# EAGLE design nRF24LU1+ (EAGLE 7.0.0)
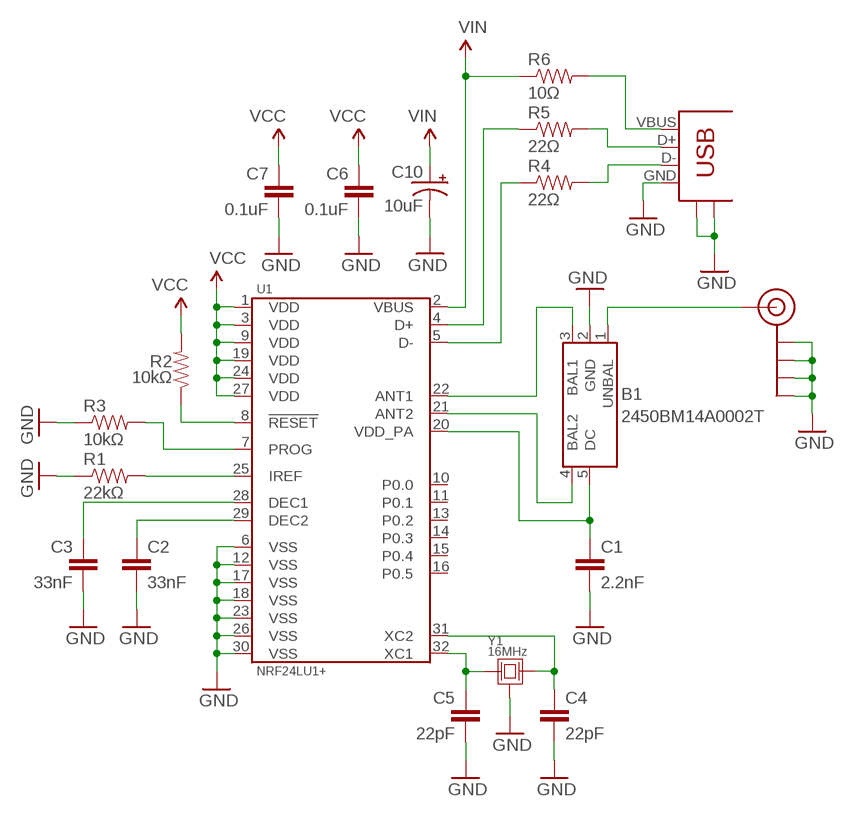
[diagram p0: schematic, sheet 1]

## Parts
B1  2450BM14A0002T  [BALUN-0603]
C1  2.2nF  CAP0402-CAP  [0402-CAP]
C2  33nF  CAP0402-CAP  [0402-CAP]
C3  33nF  CAP0402-CAP  [0402-CAP]
C4  22pF  CAP0402-CAP  [0402-CAP]
C5  22pF  CAP0402-CAP  [0402-CAP]
C6  0.1uF  CAP0402-CAP  [0402-CAP]
C7  0.1uF  CAP0402-CAP  [0402-CAP]
C10  10uF  CAP_POL0805  [0805-CAP_POL]
J1  USB+SHIELD-A-H  [USB-A-H]
J$1  SMA_EDGE  [SMA-EDGE]
R1  22kΩ  RESISTOR0402-RES  [0402-RES]
R2  10kΩ  RESISTOR0402-RES  [0402-RES]
R3  10kΩ  RESISTOR0402-RES  [0402-RES]
R4  22Ω  RESISTOR0402-RES  [0402-RES]
R5  22Ω  RESISTOR0402-RES  [0402-RES]
R6  10Ω  RESISTOR0402-RES  [0402-RES]
U1  NRF24LU1+  [QFN-32]
Y1  16MHz  CRYSTAL-3.2X2.5  [FA-238]

## Nets
GND: B1.2(GND) C1.2 C2.2 C3.2 C4.2 C5.2 C6.2 C7.2 C10.C(-) J1.GND J1.GND2(S1) J1.GND3(S2) J$1.GND@0(GND) J$1.GND@1(GND) J$1.GND@2(GND) J$1.GND@3(GND) R1.1 R3.1 U1.6(VSS) U1.12(VSS) U1.17(VSS) U1.18(VSS) U1.23(VSS) U1.26(VSS) U1.30(VSS) Y1.2(GND) Y1.4(GND)
N$1: R2.1 U1.8(!RESET)
N$2: C2.1 U1.29(DEC2)
N$3: C3.1 U1.28(DEC1)
N$4: R1.2 U1.25(IREF)
N$5: R3.2 U1.7(PROG)
N$6: C5.1 U1.32(XC1) Y1.1
N$7: C4.1 U1.31(XC2) Y1.3
N$8: B1.4(BAL2) U1.21(ANT2)
N$9: B1.3(BAL1) U1.22(ANT1)
N$10: B1.5(DC) C1.1 U1.20(VDD_PA)
N$11: B1.1(UNBAL) J$1.SIG(SIGNAL)
N$12: J1.D+ R5.2
N$13: J1.D- R4.2
N$14: J1.VBUS R6.2
N$16: R5.1 U1.4(D+)
N$17: R4.1 U1.5(D-)
VCC: C6.1 C7.1 R2.2 U1.1(VDD) U1.3(VDD) U1.9(VDD) U1.19(VDD) U1.24(VDD) U1.27(VDD)
VIN: C10.A(+) R6.1 U1.2(VBUS)
Unconnected: U1.10(P0.0) U1.11(P0.1) U1.13(P0.2) U1.14(P0.3) U1.15(P0.4) U1.16(P0.5)

## Library data of the parts
B1 = SparkFun-RF:2450BM14A0002T
C1-C7 = SparkFun-Passives:CAP: Capacitor Standard 0603 ceramic capacitor, and 0.1" leaded capacitor.
C10 = SparkFun-Passives:CAP_POL: Capacitor Polarized These are standard SMD and PTH capacitors. Normally 10uF, 47uF, and 100uF in electrolytic and tantalum varieties. Always verify the external diameter of the through hole cap, it varies with capacity, voltage, and manufacturer. The EIA devices should be standard.
J1 = SparkFun-Connectors:USB+SHIELD: USB+Shield USB connector with shield pins connectable
J$1 = SparkFun-Connectors:SMA_EDGE: SMA Antenna Connector End launch SMA connector. The paste layer has been removed so that the connector can be hand soldered onto the board after reflow.
R1-R6 = SparkFun-Passives:RESISTOR: Resistor Basic schematic elements and footprints for 0603, 1206, and PTH resistors.
U1 = Nordic:NRF24LU1+
Y1 = Passives:CRYSTAL

## Board
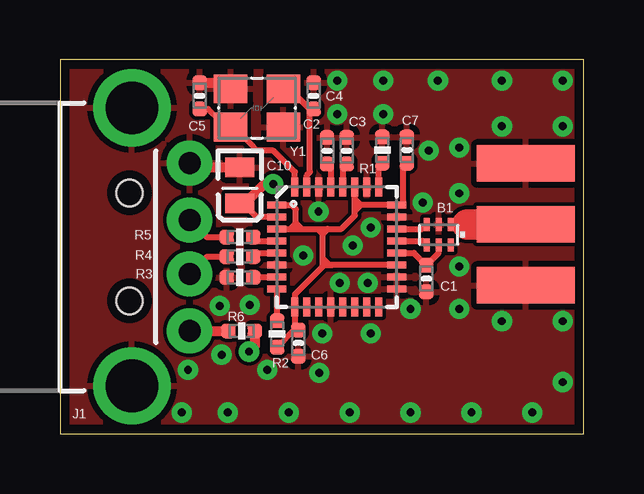
[diagram p1: board, top side]
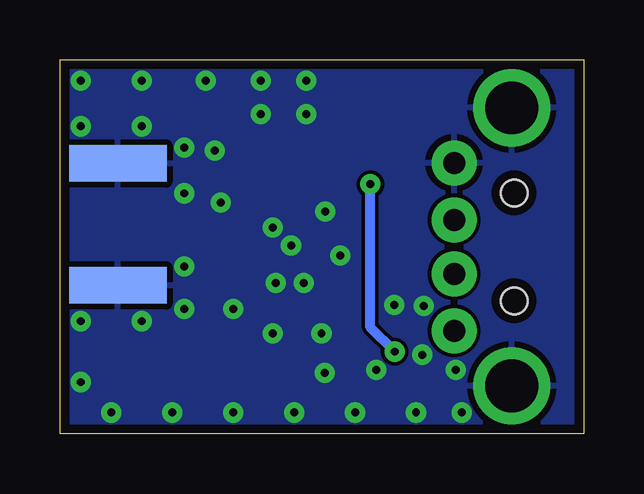
[diagram p2: board, bottom side, seen from below]

Size 21.82 x 15.6 mm. Coordinates in mm from the lower left corner, seen from the top.
Outline: 0,0 21.82,0 21.82,15.6 0,15.6 0,0
Copper layers (1*16): Top 0.0356mm / dielectric 1.5011mm / Bottom 0.0356mm
Design rules "LaenPCBOrder": minimum track width 6mil, minimum drill 13mil, track to track 6mil, track to pad 6mil, pad to pad 6mil, via to via 6mil, smd to smd 6mil, copper to edge 15mil, drill to drill 6mil, minimum pad ring 12mil, minimum via ring 10mil, stop-mask expansion 4mil, vias tented up to drill 15mil, thermal gap 10mil

### Footprints (pad centres in the part's own frame; a part is rotated, then mirrored left to right if it is on the bottom)
BALUN-0603 = smd 0.55 x 0.25: 1 -0.425,0.5; 2 -0.425,0; 3 -0.425,-0.5; 4 0.425,-0.5; 5 0.425,0; 6 0.425,0.5
0402-CAP = smd 0.6 x 0.6: 1 -0.55,0; 2 0.55,0
0805-CAP_POL = smd 0.8 x 1.2: A 0.75,0; C -0.75,0
USB-A-H = drill 0.914 pad 1.88: D+ 2.4,1.127; D- 2.4,-1.127; GND 2.4,3.5; VBUS 2.4,-3.5 | drill 2.2: GND2 0,-5.8; GND3 0,5.8 | hole 1.1: -0.1,2.25; -0.1,-2.25
SMA-EDGE = smd 1.524 x 4.064: GND@0 0,0; GND@1 5.08,0; SIG 2.54,0 | smd 1.524 x 4.064 bottom: GND@2 0,0; GND@3 5.08,0
0402-RES = smd 0.6 x 0.6: 1 -0.55,0; 2 0.55,0
QFN-32 = smd 0.285 x 0.8: 1 -1.75,-2.5; 2 -1.25,-2.5; 3 -0.75,-2.5; 4 -0.25,-2.5; 5 0.25,-2.5; 6 0.75,-2.5; 7 1.25,-2.5; 8 1.75,-2.5; 17 1.75,2.5; 18 1.25,2.5; 19 0.75,2.5; 20 0.25,2.5; 21 -0.25,2.5; 22 -0.75,2.5; 23 -1.25,2.5; 24 -1.75,2.5 | smd 0.8 x 0.285: 9 2.5,-1.75; 10 2.5,-1.25; 11 2.5,-0.75; 12 2.5,-0.25; 13 2.5,0.25; 14 2.5,0.75; 15 2.5,1.25; 16 2.5,1.75; 25 -2.5,1.75; 26 -2.5,1.25; 27 -2.5,0.75; 28 -2.5,0.25; 29 -2.5,-0.25; 30 -2.5,-0.75; 31 -2.5,-1.25; 32 -2.5,-1.75
FA-238 = smd 1.4 x 1.2: 1 -1.1,-0.8; 2 1.1,-0.8; 3 1.1,0.8; 4 -1.1,0.8

### Placement (x,y rotation side)
B1  15.77,8.31 270 top
C1  15.27,6.48 270 top
C2  11.13,11.81 90 top
C3  11.94,11.81 90 top
C4  10.57,14.1 90 top
C5  5.82,14.1 90 top
C6  9.93,3.78 270 top
C7  14.45,11.84 90 top
C10  7.49,10.36 270 top
J1  3,7.8 0 top
J$1  19.41,6.2 90 top
R1  13.44,11.84 270 top
R2  9.04,4.17 270 top
R3  7.49,6.53 0 top
R4  7.49,7.39 180 top
R5  7.49,8.2 180 top
R6  7.57,4.29 180 top
U1  11.53,7.8 270 top
Y1  8.2,13.59 0 top

### Tracks (layer width: path | path; a pad name or v marks a point on that pad's centre or on a via)
GND  (via drill 0.33)
  Top 0.406: C5.2 6.85,14.65 Y1.4 | C10.C 5.58,11.11 J1.GND
  other vias: 10.77,9.27 10.13,7.44 6.65,5.33 7.9,5.38 12.95,8.61 12.83,6.3 12.19,7.85 11.66,6.3 20.95,2.16 20.95,12.83 18.41,12.83 16.64,11.94 20.95,14.73 18.41,14.73 15.75,14.73 13.46,14.73 11.56,14.73 11.56,13.34 16.64,10.03 20.95,4.7 18.41,4.7 16.64,6.99 16.64,5.21 12.06,0.89 19.68,0.89 17.14,0.89 14.61,0.89 9.53,0.89 6.99,0.89 5.08,0.89 5.33,2.67 10.92,4.19 14.61,5.21 12.95,4.19 15.11,9.65 13.46,13.34 15.37,11.81 6.73,3.3 8.64,2.67 10.79,2.54
  pour Top: -1.27,17.78 27.94,17.78 27.94,-1.27 -1.27,-1.27
  pour Bottom: -2.54,19.05 -2.54,-2.54 29.21,-2.54 29.21,19.05
N$1
  Top 0.254: 8.94,6.05 U1.8 R2.1
N$2
  Top 0.254: C2.1 11.28,11.05 U1.29
N$3
  Top 0.254: C3.1 11.78,11.15 U1.28
N$4
  Top 0.254: U1.25 13.28,11.29 R1.2
N$5
  Top 0.254: R3.2 8.06,6.55 U1.7
N$6
  Top 0.254: U1.32 9.78,10.92 8.89,11.81 8.2,11.81 7.28,12.79 Y1.1 6.81,13.08 6.63,13.08 6.16,13.55 C5.1
N$7
  Top 0.254: U1.31 10.28,10.79 10.41,10.92 10.41,13.34 C4.1 10.4,13.55 9.83,14.12 9.57,14.12 Y1.3
N$8
  Top 0.254: U1.21 15.11,8.05 B1.4
N$9
  Top 0.254: U1.22 15.09,8.55 B1.3
N$10
  Top 0.254: U1.20 14.74,7.55 C1.1 15.77,7.54 B1.5
N$11
  Top 0.254: 16.97,8.74 17,8.73 B1.1 16.28,8.71 | 16.28,8.71 16.28,8.87 16.69,8.87 | 16.28,8.71 16.28,8.59 16.87,8.59
  Top 1.27: J$1.SIG 16.97,8.74
N$12
  Top 0.254: J1.D+ 6.12,8.2 R5.2
N$13
  Top 0.254: J1.D- 6.12,7.39 R4.2
N$14
  Top 0.406: J1.VBUS R6.2
N$16
  Top 0.254: R5.1 8.2,8.05 U1.4
N$17
  Top 0.254: R4.1 8.2,7.55 U1.5
VCC
  Top 0.254: U1.1 9.65,9.55 9.83,9.37 9.83,8.79 | 9.83,8.79 9.83,8.78 9.6,8.55 | 12.28,9.6 12.28,9.11 11.72,8.55 11.15,8.55 | 12.28,9.66 U1.27 | 12.28,9.6 12.34,9.55 U1.24 14.3,9.55 14.3,11.29 C7.1 | 12.29,9.78 12.34,9.73 | 12.34,9.73 12.52,9.55 12.29,9.32 | 12.28,9.6 12.28,9.66 | 12.28,9.66 12.34,9.73 | U1.9 9.78,4.36 | 9.78,4.36 R2.2 | 9.78,5.51 U1.9 | U1.3 9.6,8.55 | 9.6,8.55 11.15,8.55 | 9.83,8.79 10.06,8.56 | 10.95,6.99 10.95,7.04 | 10.95,7.04 10.95,7.32 | 10.95,7.32 10.95,8.33 | 10.95,8.33 10.95,8.35 11.15,8.55 | 10.95,8.33 10.74,8.53 | 10.95,6.99 9.78,5.82 U1.9 | U1.19 11.21,7.05 10.95,7.32 | 10.95,7.04 10.96,7.05 11.37,7.05 | 10.95,6.99 11.04,7.07 11.05,7.07 | 9.78,4.36 9.91,4.36 C6.1
VIN  (via drill 0.33)
  Top 0.254: U1.2 8.2,9.05 7.63,9.61 C10.A
  Top 0.406: v8.89,10.41 8.51,10.41 7.71,9.61 C10.A | R6.1 8.12,3.67 v7.87,3.43
  Bottom 0.406: v7.87,3.43 8.89,4.45 v8.89,10.41